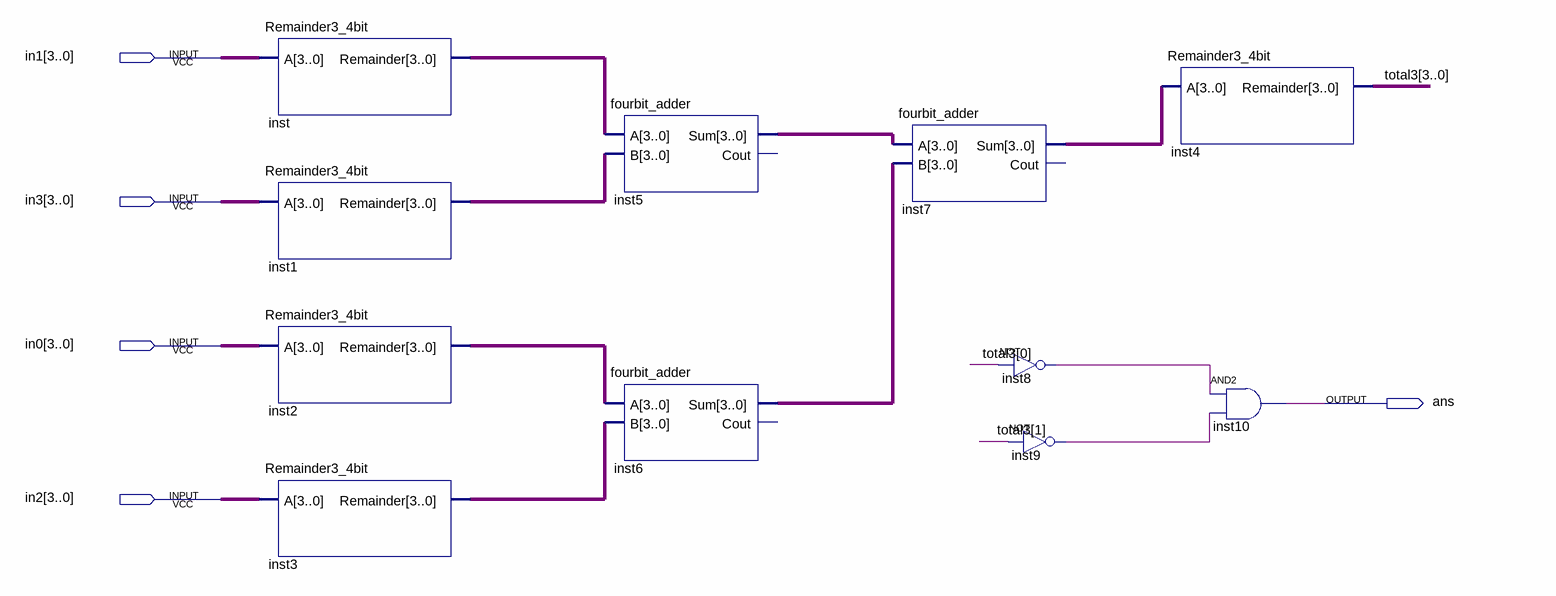
[diagram p0: schematic sheet]
// Quartus schematic divideable3.bdf as structural Verilog: 11 symbols, 5 pins
module divideable3 (
  input  [3:0] in1,
  input  [3:0] in3,
  input  [3:0] in0,
  input  [3:0] in2,
  output ans
);

  wire inst8_out, inst9_out;
  wire [3:0] inst1_remainder, inst2_remainder, inst3_remainder, inst5_sum, inst6_sum, inst7_sum,
       inst_remainder, total3;

  Remainder3_4bit inst (.A(in1), .Remainder(inst_remainder));
  Remainder3_4bit inst1 (.A(in3), .Remainder(inst1_remainder));
  Remainder3_4bit inst2 (.A(in0), .Remainder(inst2_remainder));
  Remainder3_4bit inst3 (.A(in2), .Remainder(inst3_remainder));
  fourbit_adder inst5 (.A(inst_remainder), .B(inst1_remainder), .Sum(inst5_sum));  // open: Cout
  fourbit_adder inst6 (.A(inst2_remainder), .B(inst3_remainder), .Sum(inst6_sum));  // open: Cout
  fourbit_adder inst7 (.A(inst5_sum), .B(inst6_sum), .Sum(inst7_sum));  // open: Cout
  not inst8 (inst8_out, total3[0]);
  not inst9 (inst9_out, total3[1]);
  Remainder3_4bit inst4 (.A(inst7_sum), .Remainder(total3));
  and inst10 (ans, inst8_out, inst9_out);
endmodule
